# EAGLE schematic eagle schematic (EAGLE 8.2.0)
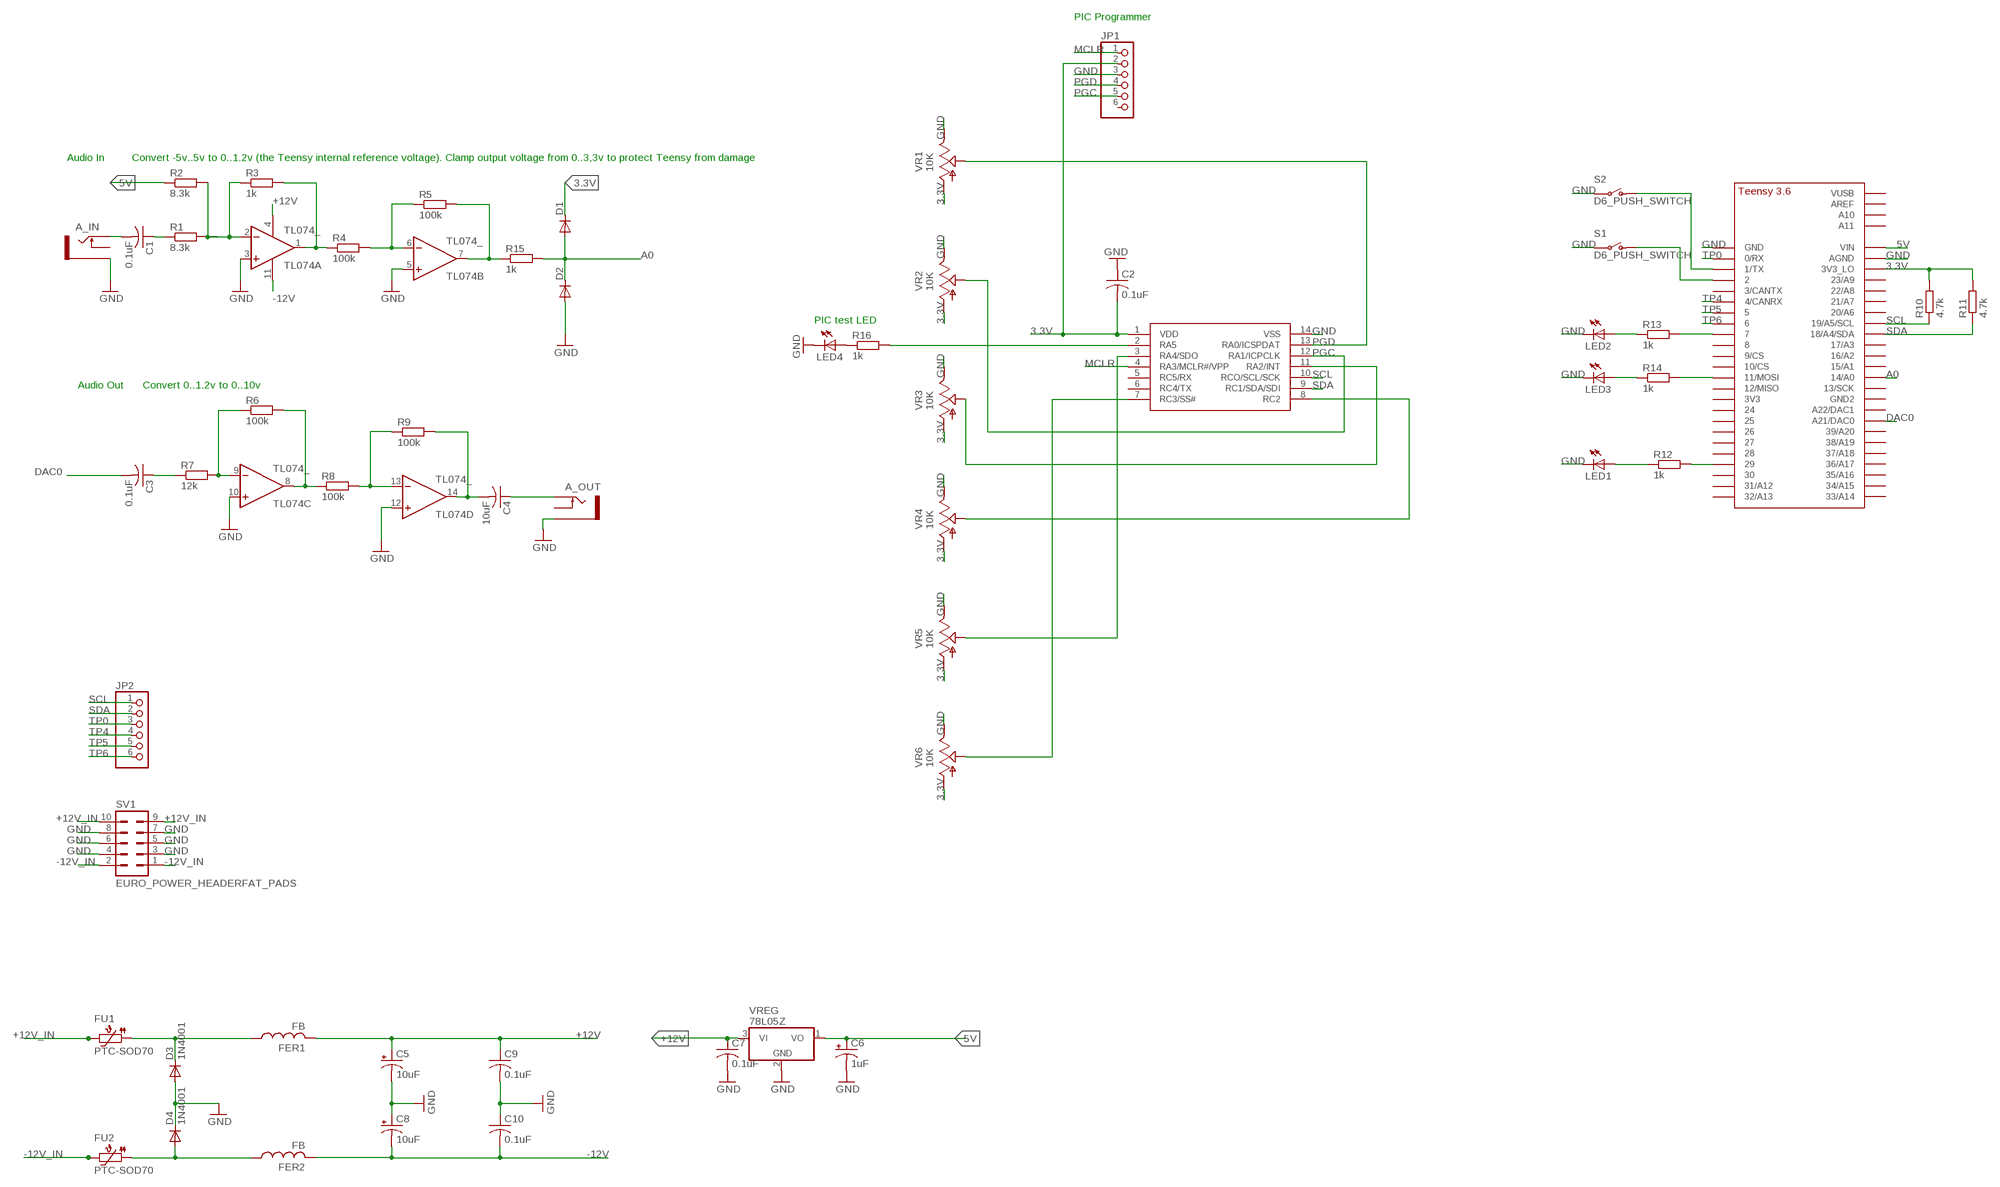
[diagram p0: schematic, sheet 1]

## Parts
A_IN  THONKICONNNEW  [WQP-PJ301M-12_JACK]
A_OUT  THONKICONNNEW  [WQP-PJ301M-12_JACK]
C1  0.1uF  C-US025-030X050  [C025-030X050]
C2  0.1uF  C-US025-030X050  [C025-030X050]
C3  0.1uF  C-US025-030X050  [C025-030X050]
C4  10uF  C-US025-030X050  [C025-030X050]
C5  10uF  CPOL-USE2,5-6E  [E2,5-6E]
C6  1uF  CPOL-USE2.5-7  [E2,5-7]
C7  0.1uF  C-US025-030X050  [C025-030X050]
C8  10uF  CPOL-USE2,5-6E  [E2,5-6E]
C9  0.1uF  C-US025-030X050  [C025-030X050]
C10  0.1uF  C-US025-030X050  [C025-030X050]
D1  SMALL_DIODEDO35-7  [DO35-7]
D2  SMALL_DIODEDO35-7  [DO35-7]
D3  1N4001  1N4004  [DO41-10]
D4  1N4001  1N4004  [DO41-10]
FER1  FB  [FB]
FER2  FB  [FB]
FU1  PTC-SOD70  [SOD70]
FU2  PTC-SOD70  [SOD70]
JP1  PINHD-1X6  [1X06]
JP2  PINHD-1X6  [1X06]
LED1  LED3MM  [LED3MM]
LED2  LED3MM  [LED3MM]
LED3  LED3MM  [LED3MM]
LED4  LED3MM  [LED3MM]
PIC  PIC16F1825DIL14  [DIL14]
R1  8.3k  RESISTOR7MM  [7MM_RESISTOR]
R2  8.3k  RESISTOR7MM  [7MM_RESISTOR]
R3  1k  RESISTOR7MM  [7MM_RESISTOR]
R4  100k  RESISTOR7MM  [7MM_RESISTOR]
R5  100k  RESISTOR7MM  [7MM_RESISTOR]
R6  100k  RESISTOR7MM  [7MM_RESISTOR]
R7  12k  RESISTOR7MM  [7MM_RESISTOR]
R8  100k  RESISTOR7MM  [7MM_RESISTOR]
R9  100k  RESISTOR7MM  [7MM_RESISTOR]
R10  4.7k  RESISTOR7MM  [7MM_RESISTOR]
R11  4.7k  RESISTOR7MM  [7MM_RESISTOR]
R12  1k  RESISTOR7MM  [7MM_RESISTOR]
R13  1k  RESISTOR7MM  [7MM_RESISTOR]
R14  1k  RESISTOR7MM  [7MM_RESISTOR]
R15  1k  RESISTOR7MM  [7MM_RESISTOR]
R16  1k  RESISTOR7MM  [7MM_RESISTOR]
S1  D6_PUSH_SWITCH  [D6_PUSH_SWITCH]
S2  D6_PUSH_SWITCH  [D6_PUSH_SWITCH]
SV1  EURO_POWER_HEADERFAT_PADS  [EURO_PWR_HEADER_FAT]
TL074  TL074_  [DIL14]
U$1  TEENSY_3.5/3.6_BASIC  [TEENSY_3.5/3.6_BASIC]
VR1  10K  9MM_SNAP-IN_POT_  [9MM_SNAP-IN_POT]
VR2  10K  9MM_SNAP-IN_POT_  [9MM_SNAP-IN_POT]
VR3  10K  9MM_SNAP-IN_POT_  [9MM_SNAP-IN_POT]
VR4  10K  9MM_SNAP-IN_POT_  [9MM_SNAP-IN_POT]
VR5  10K  9MM_SNAP-IN_POT_  [9MM_SNAP-IN_POT]
VR6  10K  9MM_SNAP-IN_POT_  [9MM_SNAP-IN_POT]
VREG  78L05Z  [TO92]

## Nets
3.3V: C2.2 D1.C JP1.2 PIC.1(VDD) R10.2 R11.2 U$1.3V3_LO VR1.1(A) VR2.1(A) VR3.1(A) VR4.1(A) VR5.1(A) VR6.1(A)
5V: C6.+ R2.1 U$1.VIN VREG.1(VO)
+12V: C5.+ C7.1 C9.1 FER1.P$2 TL074.4(P:V+) VREG.3(VI)
+12V_IN: FU1.2 SV1.9 SV1.10
-12V: C8.- C10.2 FER2.P$2 TL074.11(P:V-)
-12V_IN: FU2.2 SV1.1 SV1.2
A0: D1.A D2.C R15.2 U$1.14/A0
DAC0: C3.2 U$1.21/DAC0(A21/DAC0)
GND: A_IN.P$3_SLEEVE(SLEEVE) A_OUT.P$3_SLEEVE(SLEEVE) C2.1 C5.- C6.- C7.2 C8.+ C9.2 C10.1 D2.A D3.A D4.C JP1.3 LED1.K(C) LED2.K(C) LED3.K(C) LED4.K(C) PIC.14(VSS) S1.P$3(P) S1.P$4(P) S2.P$3(P) S2.P$4(P) SV1.3 SV1.4 SV1.5 SV1.6 SV1.7 SV1.8 TL074.3(A:+IN) TL074.5(B:+IN) TL074.10(C:+IN) TL074.12(D:+IN) U$1.AGND U$1.GND VR1.3(E) VR2.3(E) VR3.3(E) VR4.3(E) VR5.3(E) VR6.3(E) VREG.2(GND)
MCLR: JP1.1 PIC.4(RA3/MCLR#/VPP)
N$1: LED4.A R16.1
N$2: A_IN.P$1_TIP(TIP) C1.2
N$3: R1.2 R2.2 R3.1 TL074.2(A:-IN)
N$4: R3.2 R4.1 TL074.1(A:OUT)
N$5: PIC.2(RA5) R16.2
N$6: R4.2 R5.1 TL074.6(B:-IN)
N$7: C1.1 R1.1
N$8: R5.2 R15.1 TL074.7(B:OUT)
N$9: LED1.A R12.1
N$10: PIC.11(RA2/INT) VR3.2(S)
N$11: PIC.8(RC2) VR4.2(S)
N$12: PIC.3(RA4/SDO) VR5.2(S)
N$13: C3.1 R7.1
N$14: R6.1 R7.2 TL074.9(C:-IN)
N$15: PIC.7(RC3/SS#) VR6.2(S)
N$16: R6.2 R8.1 TL074.8(C:OUT)
N$17: R12.2 U$1.29
N$18: R8.2 R9.1 TL074.13(D:-IN)
N$19: LED2.A R13.1
N$20: S1.P$1(O) S1.P$2(O) U$1.2
N$21: C4.2 R9.2 TL074.14(D:OUT)
N$22: A_OUT.P$1_TIP(TIP) C4.1
N$23: LED3.A R14.1
N$25: S2.P$1(O) S2.P$2(O) U$1.1/TX
N$26: R13.2 U$1.7
N$27: R14.2 U$1.11/MOSI
N$29: D3.C FER1.P$1 FU1.1
N$30: D4.A FER2.P$1 FU2.1
PGC: JP1.5 PIC.12(RA1/ICPCLK) VR2.2(S)
PGD: JP1.4 PIC.13(RA0/ICSPDAT) VR1.2(S)
SCL: JP2.1 PIC.10(RCO/SCL/SCK) R10.1 U$1.19/A5/SCL
SDA: JP2.2 PIC.9(RC1/SDA/SDI) R11.1 U$1.18/A4/SDA
TP0: JP2.3 U$1.0/RX
TP4: JP2.4 U$1.4/CANRX
TP5: JP2.5 U$1.5
TP6: JP2.6 U$1.6
Unconnected: A_IN.P$2_SWITCH(SWITCH) A_OUT.P$2_SWITCH(SWITCH) JP1.6 PIC.5(RC5/RX) PIC.6(RC4/TX) U$1.3/CANTX U$1.3V3 U$1.8 U$1.9/CS U$1.10/CS U$1.12/MISO U$1.13/SCK U$1.15/A1 U$1.16/A2 U$1.17/A3 U$1.20/A6 U$1.21/A7 U$1.22/A8 U$1.23/A9 U$1.24 U$1.25 U$1.26 U$1.27 U$1.28 U$1.30 U$1.31/A12 U$1.32/A13 U$1.33/A14 U$1.34/A15 U$1.35/A16 U$1.36/A17 U$1.37/A18 U$1.38/A19 U$1.39/A20 U$1.A10 U$1.A11 U$1.A22/DAC1 U$1.AREF U$1.GND2 U$1.VUSB

## Notes on the sheet
- PIC Programmer
- Audio In | Convert -5v..5v to 0..1.2v (the Teensy internal reference voltage). Clamp output voltage from 0..3,3v to protect Teensy from damage
- PIC test LED
- Audio Out | Convert 0..1.2v to 0..10v

## Library data of the parts
A_IN A_OUT = MusicThingModular:THONKICONN: 3.5mm socket for Eurorack modular synths
C1-C4 C7 C9 C10 = adafruit:C-US: CAPACITOR, American symbol
C5 C6 C8 = adafruit:CPOL-US: POLARIZED CAPACITOR, American symbol
D1 D2 = MusicThingModular:SMALL_DIODE: Small Signal Diode
D3 D4 = adafruit:1N4004: DIODE General purpose 1N400x type rectifier (With bigger pads) http://www.ladyada.net/library/pcb/eaglelibrary.html
FER1 FER2 = adafruit:FB: Ferrite bead Digikey #P9821BK-ND
FU1 FU2 = ptc-ntc:PTC-: Positive Temperature Coefficient Resistor (PTC) termistor Philips KTY81-210 - KTY81-252 Source: 153627-da-01-en-Temperatur-Sensor_KTY10-6_Philips.pdf; OC_FARNELL: unknown; OC_NEWARK: unknown
JP1 JP2 = adafruit:PINHD-1X6: PIN HEADER
LED1-LED4 = adafruit:LED: LED OSRAM: - CHIPLED LG R971, LG N971, LY N971, LG Q971, LY Q971, LO R971, LY R971 LH N974, LH R974 LS Q976, LO Q976, LY Q976 LO Q996 - Hyper CHIPLED LW Q18S LB Q993, LB Q99A, LB R99A - SideLED LS A670, LO A670, LY A670, LG A670, LP A670 LB A673, LV A673, LT A673, LW A673 LH A674 LY A675 LS A676, LA A676, LO A676, LY A676, LW A676 LS A679, LY A679, LG A679 - Hyper Micro SIDELED® LS Y876, LA Y876, LO Y876, LY Y876 LT Y87S - SmartLED LW L88C, LW L88S LB L89C, LB L89S, LG L890 LS L89K, LO L89K, LY L89K LS L896, LA L896, LO L896, LY L896 - TOPLED LS T670, LO T670, LY T670, LG T670, LP T670 LSG T670, LSP T670, LSY T670, LOP T670, LYG T670 LG T671, LOG T671, LSG T671 LB T673, LV T673, LT T673, LW T673 LH T674 LS T676, LA T676, LO T676, LY T676, LB T676, LH T676, LSB T676, LW T676 LB T67C, LV T67C, LT T67C, LS T67K, LO T67K, LY T67K, LW E67C LS E67B, LA E67B, LO E67B, LY E67B, LB E67C, LV E67C, LT E67C LW T67C LS T679, LY T679, LG T679 LS T770, LO T770, LY T770, LG T770, LP T770 LB T773, LV T773, LT T773, LW T773 LH T774 LS E675, LA E675, LY E675, LS T675 LS T776, LA T776, LO T776, LY T776, LB T776 LHGB T686 LT T68C, LB T68C - Hyper Mini TOPLED® LB M676 - Mini TOPLED Santana® LG M470 LS M47K, LO M47K, LY M47K Source: http://www.osram.convergy.de/
PIC = jasons_stuff:PIC16F1825
R1-R16 = MusicThingModular:RESISTOR: Standard resistor, various versions
S1 S2 = MusicThingModular:D6_PUSH_SWITCH: Push switch
SV1 = MusicThingModular:EURO_POWER_HEADER: Power Header 10 pin power header for Eurorack Power Supplies Variants with fatter pads for easier soldering, and the LOCK variant which has 5mil offset pins to hold the component in place before soldering
TL074 = MusicThingModular:TL074: Generic Quad Op Amp
U$1 = Teensy356:TEENSY_3.5/3.6_BASIC
VR1-VR6 = MusicThingModular:9MM_SNAP-IN_POT: 9mm vertical snap-in pot, Alpha / Panasonic style
VREG = adafruit:78*: Positive VOLTAGE REGULATOR Added bigger pads to the TO-92 package